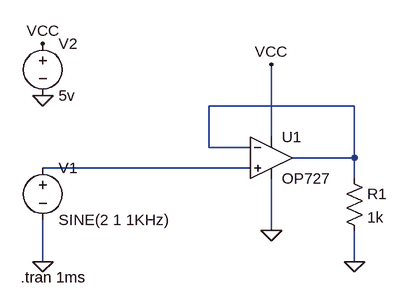
[diagram p0: schematic template1.asc]
template1.asc, the LTspice schematic file:
Version 4
SHEET 1 880 680
WIRE 176 48 -48 48
WIRE 48 96 48 -16
WIRE -48 112 -48 48
WIRE 16 112 -48 112
WIRE 176 128 176 48
WIRE 176 128 80 128
WIRE 16 144 -304 144
WIRE 176 160 176 128
WIRE 48 240 48 160
WIRE -304 288 -304 224
WIRE 176 288 176 240
FLAG 176 288 0
FLAG -304 288 0
FLAG 48 240 0
FLAG 48 -16 VCC
FLAG -304 -48 VCC
FLAG -304 32 0
SYMBOL res 160 144 R0
SYMATTR InstName R1
SYMATTR Value 1k
SYMBOL voltage -304 128 R0
WINDOW 123 0 0 Left 0
WINDOW 39 0 0 Left 0
SYMATTR InstName V1
SYMATTR Value SINE(2 1 1KHz)
SYMBOL voltage -304 -64 R0
WINDOW 123 0 0 Left 0
WINDOW 39 0 0 Left 0
SYMATTR InstName V2
SYMATTR Value 5v
SYMBOL Opamps\\OP727 48 64 R0
SYMATTR InstName U1
TEXT -338 312 Left 2 !.tran 1ms

The netlist it stands for:
* template1.asc
R1 N001 0 1k
V1 N002 0 SINE(2 1 1KHz)
V2 VCC 0 5v
XU1 N002 N001 VCC 0 N001 OP727  ; pins In+ In- V+ V- OUT
.tran 1ms
.backanno
.end